# Altium project Exjobb.PrjPcb
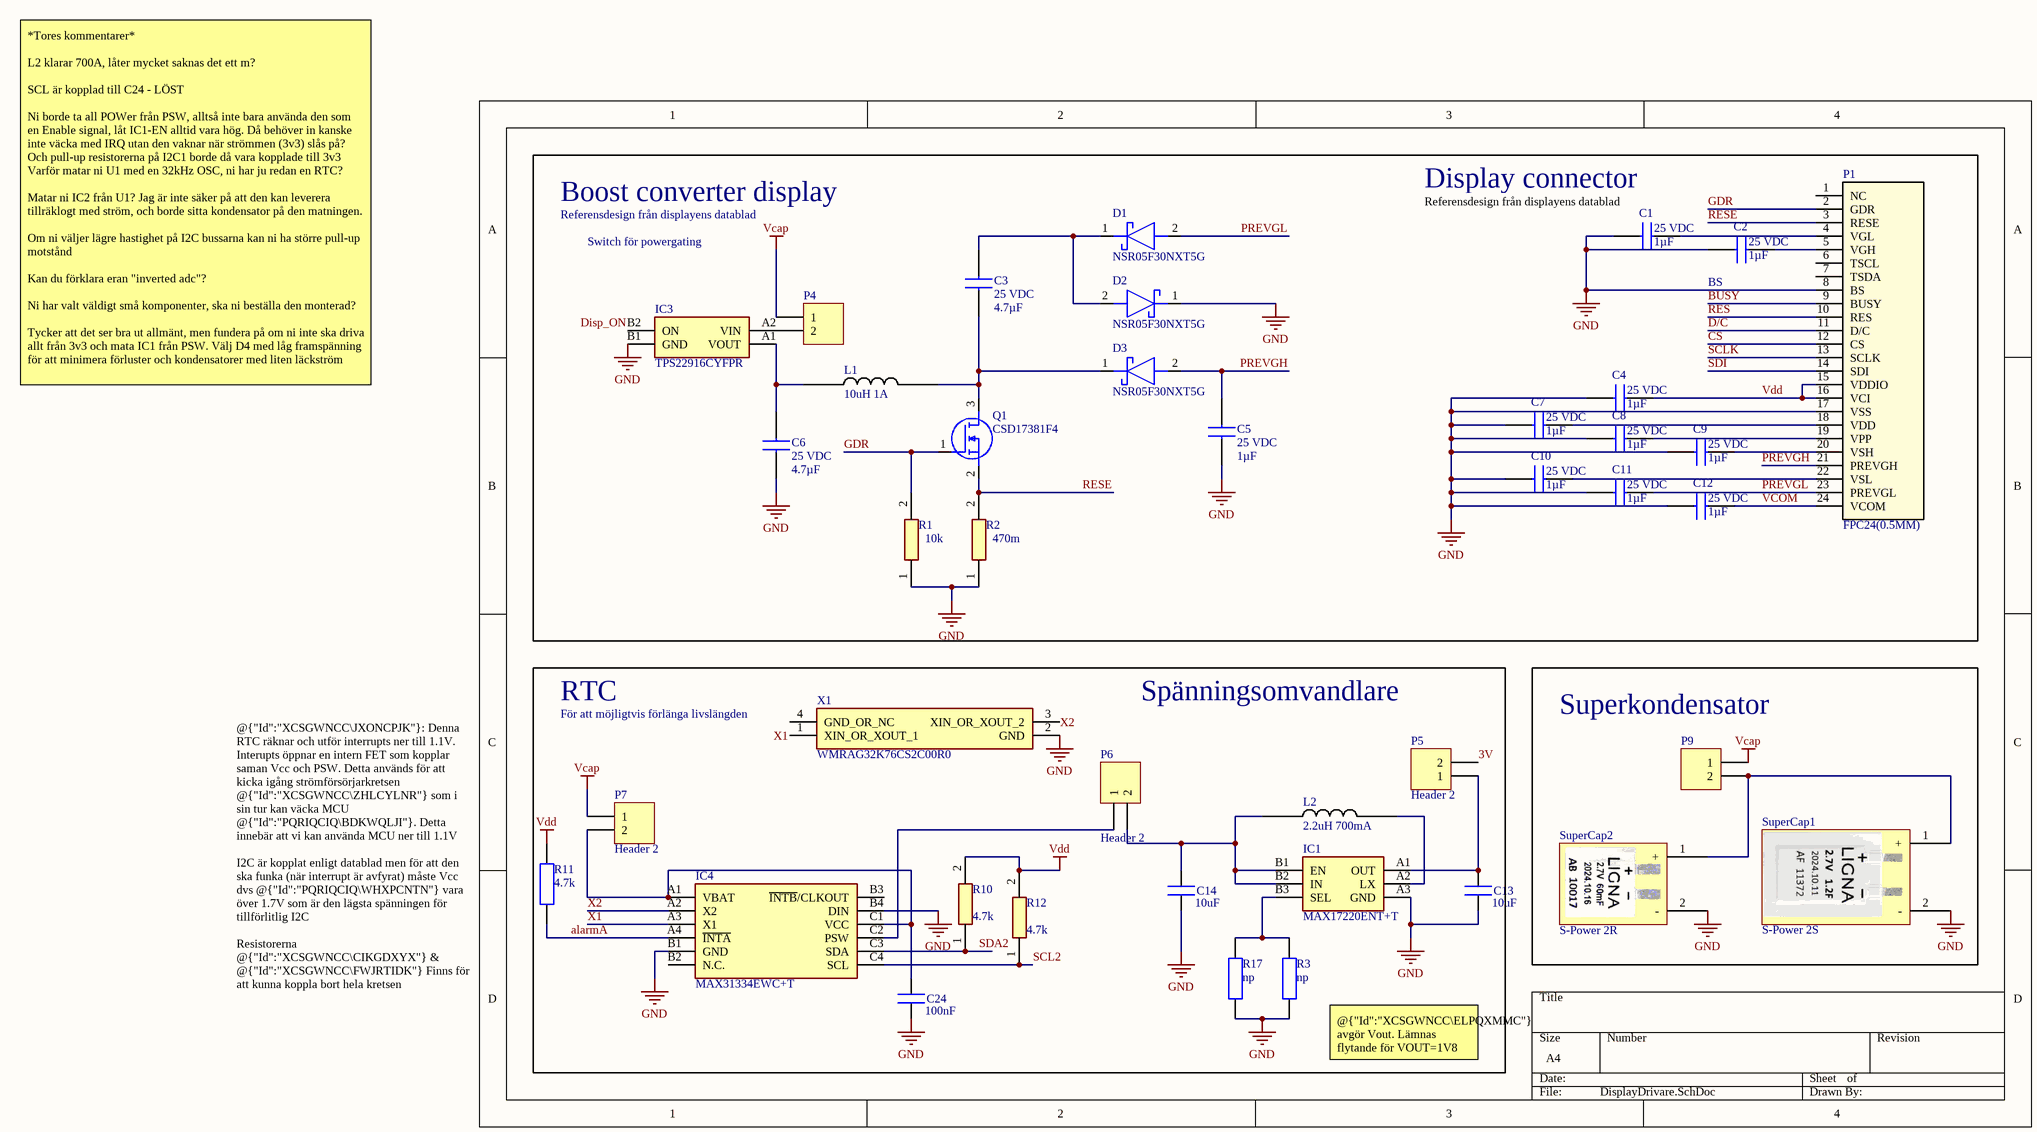
[diagram p0: DisplayDrivare.SchDoc]
2 sheets, 73 parts. Net scope: global (net labels, ports and power ports of the same name join across sheets).
Board files: PCB2.PcbDoc, PCB1.PcbDoc
Sheets:
  DisplayDrivare.SchDoc
  DigitalBlad.SchDoc

## Sheet DisplayDrivare.SchDoc
size A4; SheetNumber: 1; SheetTotal: 2

### Parts
C1  value 1µF  Rated Voltage: 25 VDC  [CAPC1005X55N]  (hidden comment: GRM155R61E105KA12D)
C2  value 1µF  Rated Voltage: 25 VDC  [CAPC1005X55N]  (hidden comment: GRM155R61E105KA12D)
C3  value 4.7µF  Rated Voltage: 25 VDC  [GRM15x]  (hidden comment: GRM155C61E475ME15J)
C4  value 1µF  Rated Voltage: 25 VDC  [CAPC1005X55N]  (hidden comment: GRM155R61E105KA12D)
C5  value 1µF  Rated Voltage: 25 VDC  [CAPC1005X55N]  (hidden comment: GRM155R61E105KA12D)
C6  value 4.7µF  Rated Voltage: 25 VDC  [GRM15x]  (hidden comment: GRM155C61E475ME15J)
C7  value 1µF  Rated Voltage: 25 VDC  [CAPC1005X55N]  (hidden comment: GRM155R61E105KA12D)
C8  value 1µF  Rated Voltage: 25 VDC  [CAPC1005X55N]  (hidden comment: GRM155R61E105KA12D)
C9  value 1µF  Rated Voltage: 25 VDC  [CAPC1005X55N]  (hidden comment: GRM155R61E105KA12D)
C10  value 1µF  Rated Voltage: 25 VDC  [CAPC1005X55N]  (hidden comment: GRM155R61E105KA12D)
C11  value 1µF  Rated Voltage: 25 VDC  [CAPC1005X55N]  (hidden comment: GRM155R61E105KA12D)
C12  value 1µF  Rated Voltage: 25 VDC  [CAPC1005X55N]  (hidden comment: GRM155R61E105KA12D)
C13  capacitance: 10uF  [CAPC1005X70N]  (hidden comment: AMK105CBJ106MV-F)
C14  capacitance: 10uF  [CAPC1005X70N]  (hidden comment: AMK105CBJ106MV-F)
C24  capacitance: 100nF  [CAPC1005X70N]  (hidden comment: MCAST105SB5104KFNA01)
D1  NSR05F30NXT5G  [NSR05F30NXT5G]
D2  NSR05F30NXT5G  [NSR05F30NXT5G]
D3  NSR05F30NXT5G  [NSR05F30NXT5G]
IC1  MAX17220ENT+T  [BGA6C40P3X2_142X89X50]
IC3  TPS22916CYFPR  [BGA4C40P2X2_78X78X50]
IC4  MAX31334EWC+T  [BGA12C50P4X3_197X147X69]
L1  Rating: 10uH 1A  [INDPM4341X80N]  (hidden comment: SRP0408F-100M)
L2  Rating: 2.2uH 700mA  [WE-PMI_080562]  (hidden comment: 74479774222)
P1  FPC24(0.5MM)  [FPC24 (0.5mm)]
P4  Header 2  [HDR1X2]  (value not drawn)
P5  Header 2  [HDR1X2]
P6  Header 2  [HDR1X2]
P7  Header 2  [HDR1X2]
P9  Header 2  [HDR1X2]  (value not drawn)
Q1  CSD17381F4  [CSD17381F4]
R1  Resistance: 10k  [RESC1005X40N]  (hidden comment: CRCW040210K0FKEDHP)
R2  Resistance: 470m  [RESC2012X65N]  (hidden comment: ERJ-U6QJR47V)
R3  resistance: np  [RESC1005X40N]  (hidden comment: CRT0402-BY-80R6GLF)
R10  Resistance: 4.7k  [RESC1005X40N]  (hidden comment: CRCW04024K70FKEDHP)
R11  resistance: 4.7k  [RESC1005X40N]  (hidden comment: CRCW04024K70FKEDHP)
R12  Resistance: 4.7k  [RESC1005X40N]  (hidden comment: CRCW04024K70FKEDHP)
R17  resistance: np  [RESC1005X40N]  (hidden comment: CRT0402-BY-80R6GLF)
SuperCap1  S-Power 2S  [S-Power 2S]
SuperCap2  S-Power 2R  [S-Power 2R]
X1  WMRAG32K76CS2C00R0  [WMRAG32K76CS2C00R0]

### Blocks framed on the sheet
Superkondensator: P9 SuperCap1 SuperCap2

### Nets
GND: C1.2 C2.2 C4.2 C5.1 C6.1 C7.2 C8.2 C9.2 C10.2 C11.2 C12.2 C13.1 C14.1 C24.2 D2.1(K) IC1.A3(GND) IC3.B1(GND) IC4.B1(GND) IC4.B4(DIN) P1.8(BS) P1.17(VSS) R1.1 R2.1 R3.1 R17.1 SuperCap1.2(-) SuperCap2.2(-) X1.2(GND)
Vcap: P4.1 P7.1 P9.1
Vdd: C4.1 P1.15(VDDIO) P1.16(VCI) R10.2 R11.1 R12.2
3V: P5.2
alarmA: IC4.A4(~{INTA}) R11.2
BUSY: P1.9(BUSY)
CS: P1.12(CS)
D/C: P1.11(D/C)
Disp_ON: IC3.B2(ON)
GDR: P1.2(GDR) Q1.1(G) R1.2
PREVGH: C5.2 D3.2(A) P1.21(PREVGH)
PREVGL: C11.1 D1.2(A) P1.23(PREVGL)
RES: P1.10(RES)
RESE: P1.3(RESE) Q1.2(S) R2.2
SCL2: IC4.C4(SCL) R12.1
SCLK: P1.13(SCLK)
SDA2: IC4.C3(SDA) R10.1
SDI: P1.14(SDI)
VCOM: C12.1 P1.24(VCOM)
X1: IC4.A3(X1) X1.1(XIN_OR_XOUT_1)
X2: IC4.A2(X2) X1.3(XIN_OR_XOUT_2)
NetC1_1: C1.1 P1.4(VGL)
NetC2_1: C2.1 P1.5(VGH)
NetC3_1: C3.1 D3.1(K) L1.2 Q1.3(D)
NetC3_2: C3.2 D1.1(K) D2.2(A)
NetC6_2: C6.2 IC3.A1(VOUT) L1.1
NetC7_1: C7.1 P1.18(VDD)
NetC8_1: C8.1 P1.19(VPP)
NetC9_1: C9.1 P1.20(VSH)
NetC10_1: C10.1 P1.22(VSL)
NetC13_2: C13.2 IC1.A1(OUT) P5.1
NetC14_2: C14.2 IC1.B1(EN) IC1.B2(IN) L2.1 P6.2
NetC24_1: C24.1 IC4.A1(VBAT) IC4.C1(VCC) P7.2
NetIC1_A2: IC1.A2(LX) L2.2
NetIC1_B3: IC1.B3(SEL) R3.2 R17.2
NetIC3_A2: IC3.A2(VIN) P4.2
NetIC4_C2: IC4.C2(PSW) P6.1
NetP9_2: P9.2 SuperCap1.1(+) SuperCap2.1(+)

Not connected (* = marked no-connect by the designer): IC4 B2(N.C.) B3(~{INTB}/CLKOUT); P1 1(NC) 6(TSCL) 7(TSDA); X1 4(GND_OR_NC)

### Notes on the sheet
- Boost converter display
- (near C1) Display connector
- (near C1) Referensdesign från displayens datablad
- Referensdesign från displayens datablad
- Switch för powergating
- (near C2) BS
- *Tores kommentarer*
  L2 klarar 700A, låter mycket saknas det ett m?
  SCL är kopplad till C24 - LÖST
  Ni borde ta all POWer från PSW, alltså inte bara använda den som en Enable signal, låt IC1-EN alltid vara hög. Då behöver in kanske inte väcka med IRQ utan den vaknar när strömmen (3v3) slås på? Och pull-up resistorerna på I2C1 borde då vara kopplade till 3v3
  Varför matar ni U1 med en 32kHz OSC, ni har ju redan en RTC?
  Matar ni IC2 från U1? Jag är inte säker på att den kan leverera tillräklogt med ström, och borde sitta kondensator på den matningen.
  Om ni väljer lägre hastighet på I2C bussarna kan ni ha större pull-up motstånd
  Kan du förklara eran "inverted adc"?
  Ni har valt väldigt små komponenter, ska ni beställa den monterad?
  Tycker att det ser bra ut allmänt, men fundera på om ni inte ska driva allt från 3v3 och mata IC1 från PSW. Välj D4 med låg framspänning för att minimera förluster och kondensatorer med liten läckström
- (near X1) För att möjligtvis förlänga livslängden
- RTC
- Spänningsomvandlare
- @{"Id":"XCSGWNCC\JXONCPJK"}: Denna RTC räknar och utför interrupts ner till 1.1V. Interupts öppnar en intern FET som kopplar saman Vcc och PSW. Detta används för att kicka igång strömförsörjarkretsen @{"Id":"XCSGWNCC\ZHLCYLNR"} som i sin tur kan väcka MCU @{"Id":"PQRIQCIQ\BDKWQLJI"}. Detta innebär att vi kan använda MCU ner till 1.1V
  I2C är kopplat enligt datablad men för att den ska funka (när interrupt är avfyrat) måste Vcc dvs @{"Id":"PQRIQCIQ\WHXPCNTN"} vara över 1.7V som är den lägsta spänningen för tillförlitlig I2C
  Resistorerna @{"Id":"XCSGWNCC\CIKGDXYX"} & @{"Id":"XCSGWNCC\FWJRTIDK"} Finns för att kunna koppla bort hela kretsen
- (near R3) @{"Id":"XCSGWNCC\ELPQXMMC"} avgör Vout. Lämnas flytande för VOUT=1V8
  133kohk = > 3V

### Library data of the parts
C1 C2 C4 C5 C7-C12 = CMP-001-00126-1: Capacitor; Manufacturer_Name: Murata Electronics; Datasheet Link: https://search.murata.co.jp/Ceramy/image/img/A01X/G101/ENG/GRM155R61E105KA12-01A.pdf; Source: SamacSys.SchLib; Mouser Part Number: 81-GRM155R61E105KA2D; Arrow Part Number: GRM155R61E105KA12D; Manufacturer_Part_Number: GRM155R61E105KA12D; Design Item ID: GRM155R61E105KA12D; Arrow Price/Stock: https://www.arrow.com/en/products/grm155r61e105ka12d/murata-manufacturing?region=nac; Height: 0.55mm; Mouser Price/Stock: https://www.mouser.co.uk/ProductDetail/Murata-Electronics/GRM155R61E105KA12D?qs=hiffU4J9V6bE4a81t2Mv5A%3D%3D
C3 C6 = CMP-001-00127-1: Capacitor; Manufacturer_Name: Murata Electronics; Height: 0.5mm; Source: SamacSys.SchLib; Arrow Price/Stock: https://www.arrow.com/en/products/grm155c61e475me15j/murata-manufacturing?region=nac; Mouser Part Number: 81-GRM15C61E475ME15J; Arrow Part Number: GRM155C61E475ME15J; Manufacturer_Part_Number: GRM155C61E475ME15J; Design Item ID: GRM155C61E475ME15J; Mouser Price/Stock: https://www.mouser.co.uk/ProductDetail/Murata-Electronics/GRM155C61E475ME15J?qs=By6Nw2ByBD02p8xq06vhEQ%3D%3D; Datasheet Link: https://search.murata.co.jp/Ceramy/image/img/A01X/G101/ENG/GRM155C61E475ME15-01A.pdf
C13 C14 = Generic capacitor: Multilayer Ceramic Capacitors MLCC - SMD/SMT 4V 10uF X5R 0402 20 %; ComponentLink1Description: New link; ComponentLink1URL: https://www.mouser.se/ProductDetail/TAIYO-YUDEN/AMK105CBJ106MV-F?qs=sGAEpiMZZMsh%252B1woXyUXj0Cks%252BXuBt5iPLxjTe7mki8%3D
C24 = Generic capacitor: Multilayer Ceramic Capacitors MLCC - SMD/SMT 25V 0.1uF X5R 0402 10% Medical; ComponentLink1Description: New link; ComponentLink1URL: https://www.mouser.se/ProductDetail/TAIYO-YUDEN/MLAST105SB5104KFNA01?qs=sGAEpiMZZMsh%252B1woXyUXj3XUfju0vRpjIEu19pL458I%3D
D1-D3 = CMP-004-00034-1: Schottky Diode; Manufacturer_Name: onsemi; Arrow Part Number: NSR05F30NXT5G; Height: 0.31mm; Datasheet Link: https://www.onsemi.com/pub/Collateral/NSR05F30.PDF; Source: SamacSys.SchLib; Arrow Price/Stock: https://www.arrow.com/en/products/nsr05f30nxt5g/on-semiconductor?region=nac; Mouser Price/Stock: https://www.mouser.co.uk/ProductDetail/onsemi/NSR05F30NXT5G?qs=Ddzdinyxz%2FkBCezibUxhIA%3D%3D; Design Item ID: NSR05F30NXT5G; Mouser Part Number: 863-NSR05F30NXT5G; Manufacturer_Part_Number: NSR05F30NXT5G
IC1 = CMP-031-00089-1: MAXIM INTEGRATED PRODUCTS - MAX17220ENT+T - DC-DC Switching Step Up Regulator; Manufacturer_Name: Analog Devices; Source: SamacSys.SchLib; Arrow Part Number: MAX17220ENT+T; Design Item ID: MAX17220ENT+T; Height: 0.5mm; Datasheet Link: https://www.analog.com/MAX17220/datasheet; Arrow Price/Stock: https://www.arrow.com/en/products/max17220entt/analog-devices?region=nac; Manufacturer_Part_Number: MAX17220ENT+T; Mouser Price/Stock: https://www.mouser.co.uk/ProductDetail/Analog-Devices-Maxim-Integrated/MAX17220ENT%2bT?qs=BZBei1rCqCAO5QX%2FSv6p6w%3D%3D; Mouser Part Number: 700-MAX17220ENT+T; Supplier: Mouser; Supplier Part Number: 594-MCS04020D8062BE0
IC3 = CMP-031-00019-1: TPS22916 5.5-V; Manufacturer_Name: Texas Instruments; Manufacturer_Part_Number: TPS22916CYFPR; Source: SamacSys.SchLib; Design Item ID: TPS22916CYFPR; Mouser Part Number: 595-TPS22916CYFPR; Mouser Price/Stock: https://www.mouser.co.uk/ProductDetail/Texas-Instruments/TPS22916CYFPR?qs=EU6FO9ffTweddKR4NsfVQg%3D%3D; Datasheet Link: http://www.ti.com/lit/gpn/tps22916; Arrow Price/Stock: https://www.arrow.com/en/products/tps22916cyfpr/texas-instruments?utm_currency=USD&region=nac; Height: 0.5mm; Arrow Part Number: TPS22916CYFPR
IC4 = CMP-031-00017-1: Ultra-Low-Power Real Time Clock with Integrated Power Switch; Manufacturer_Name: Analog Devices; Source: SamacSys.SchLib; Height: 0.69mm; Manufacturer_Part_Number: MAX31334EWC+T; Datasheet Link: https://www.analog.com/MAX31334/datasheet; Mouser Price/Stock: https://www.mouser.co.uk/ProductDetail/Analog-Devices-Maxim-Integrated/MAX31334EWC%2bT?qs=vvQtp7zwQdOckJhTSGVMeA%3D%3D; Arrow Part Number: MAX31334EWC+T; Arrow Price/Stock: https://www.arrow.com/en/products/max31334ewct/analog-devices?region=nac; Mouser Part Number: 700-MAX31334EWC+T; Design Item ID: MAX31334EWC+T
L1 = CMP-006-00031-1: Power Inductors - SMD 10 UH 20%; Design Item ID: SRP0408F-100M; Source: SamacSys.SchLib
L2 = CMP-006-00060-1: Inductor-WE; Source: Schlib.SchLib; Design Item ID: 74479774222
P1 = FPC24(0.5MM): No Description Available; Mfr_Name: Molex Connector Corporation; RefDes: RefDes; Type: Type
P4-P7 P9 = CMP-002-00143-1: Header, 2-Pin; Signal Integrity: Connector; LatestRevisionNote: Re-released for DXP Platform.; Publisher: Altium Limited; Pins: 2; LatestRevisionDate: 17-Jul-2002; Design Item ID: Header 2; Component Type: Standard; Source: Miscellaneous Connectors.SchLib
Q1 = CMP-102-000001-1: MOSFET (N-Channel); Manufacturer_Name: Texas Instruments; Mouser Price/Stock: https://www.mouser.co.uk/ProductDetail/Texas-Instruments/CSD17381F4?qs=aG%252B9dtamCDf9%2FrYwJezivw%3D%3D; Design Item ID: CSD17381F4; Manufacturer_Part_Number: CSD17381F4; Mouser Part Number: 595-CSD17381F4; Source: SamacSys.SchLib; Height: 0.36mm; Datasheet Link: https://www.ti.com/lit/gpn/csd17381f4?HQS=ti-null-null-sf-df-pf-sep-wwe&DCM=yes?hkey=EF798316E3902B6ED9A73243A3159BB0
R1 = CMP-009-00221-1: CRCW Power Resistor 0402 0.063W 10K Vishay CRCW Series Thick Film Power Resistor 0402 Case 10k +/-1% 0.125W +/-100ppm/K; Manufacturer_Part_Number: CRCW040210K0FKEDHP; Design Item ID: CRCW040210K0FKEDHP; Arrow Part Number: CRCW040210K0FKEDHP; Datasheet Link: http://www.vishay.com/docs/20035/dcrcwe3.pdf; Mouser Part Number: 71-CRCW040210K0FKEDH; Height: 0.4mm; Arrow Price/Stock: https://www.arrow.com/en/products/crcw040210k0fkedhp/vishay?utm_currency=USD&region=nac; Source: SamacSys.SchLib; Manufacturer_Name: Vishay; Mouser Price/Stock: https://www.mouser.co.uk/ProductDetail/Vishay-Dale/CRCW040210K0FKEDHP?qs=FlFvgi4rxBxmIiaeyFjrkA%3D%3D
R2 = CMP-009-00220-1: Thick Film Resistors - SMD 0805 0.25W 5% .47ohms AEC-Q200; Manufacturer_Name: Panasonic; Design Item ID: ERJ-U6QJR47V; Datasheet Link: https://industrial.panasonic.com/cdbs/www-data/pdf/RDP0000/AOA0000C334.pdf; Manufacturer_Part_Number: ERJ-U6QJR47V; Mouser Price/Stock: https://www.mouser.co.uk/ProductDetail/Panasonic/ERJ-U6QJR47V?qs=5aG0NVq1C4wLyK2PwyO%252BIA%3D%3D; Height: 0.65mm; Source: SamacSys.SchLib; Mouser Part Number: 667-ERJ-U6QJR47V
R3 R17 = Generic resistor: Thin Film Resistors 1/16watts 80.6 ohm 0.10%; ComponentLink1Description: New link; ComponentLink1URL: https://www.mouser.se/ProductDetail/Bourns/CRT0402-BY-80R6GLF?qs=sGAEpiMZZMvdGkrng054tyoJODJe%252BCGW7Yc230%2FWBYo%3D
R10 R12 = CMP-009-00230-1: CRCW Power Resistor 0402 0.063W 4K7 Vishay CRCW Series Thick Film Power Resistor 0402 Case 4.7k +/-1% 0.125W +/-100ppm/K; Source: SamacSys.SchLib; Height: 0.4mm; Manufacturer_Name: Vishay; Datasheet Link: http://www.vishay.com/docs/20035/dcrcwe3.pdf; Manufacturer_Part_Number: CRCW04024K70FKEDHP; Arrow Part Number: CRCW04024K70FKEDHP; Design Item ID: CRCW04024K70FKEDHP; Mouser Price/Stock: https://www.mouser.co.uk/ProductDetail/Vishay-Dale/CRCW04024K70FKEDHP?qs=k2%2FDWSARqgH3ASlI4vM3KQ%3D%3D; Mouser Part Number: 71-CRCW04024K70FKEDH; Arrow Price/Stock: https://www.arrow.com/en/products/crcw04024k70fkedhp/vishay?utm_currency=USD&region=nac
R11 = Generic resistor: CRCW Power Resistor 0402 0.063W 4K7 Vishay CRCW Series Thick Film Power Resistor 0402 Case 4.7k +/-1% 0.125W +/-100ppm/K; ComponentLink1Description: New link; ComponentLink1URL: *
SuperCap1 = CMP-111-000002-1: Design Item ID: S-Power 2S; Source: Schlib.SchLib
SuperCap2 = CMP-111-000001-1: Design Item ID: S-Power 2R; Source: Schlib.SchLib
X1 = CMP-003-00031-1: 32.768 kHz +/-20ppm Crystal 8pF 75 kOhms 4-SMD; Manufacturer_Name: Murata Electronics; Manufacturer_Part_Number: WMRAG32K76CS2C00R0; Mouser Part Number: 81-WMRAG32K76CS2C00R; Source: SamacSys.SchLib; Height: 0.35mm; Datasheet Link: https://www.murata.com/products/productdata/8804604674078/SPEC-WMRAG32K76CS2C00R0.pdf; Design Item ID: WMRAG32K76CS2C00R0; Mouser Price/Stock: https://www.mouser.co.uk/ProductDetail/Murata-Electronics/WMRAG32K76CS2C00R0?qs=bZr6mbWTK5kWV2uyypDEfg%3D%3D

## Sheet DigitalBlad.SchDoc
size A4; SheetNumber: 2; SheetTotal: 2; SPICEModelCachePQRIQCIQ: <root> / <DocumentId>PQRIQCIQ</DocumentId> / </root>
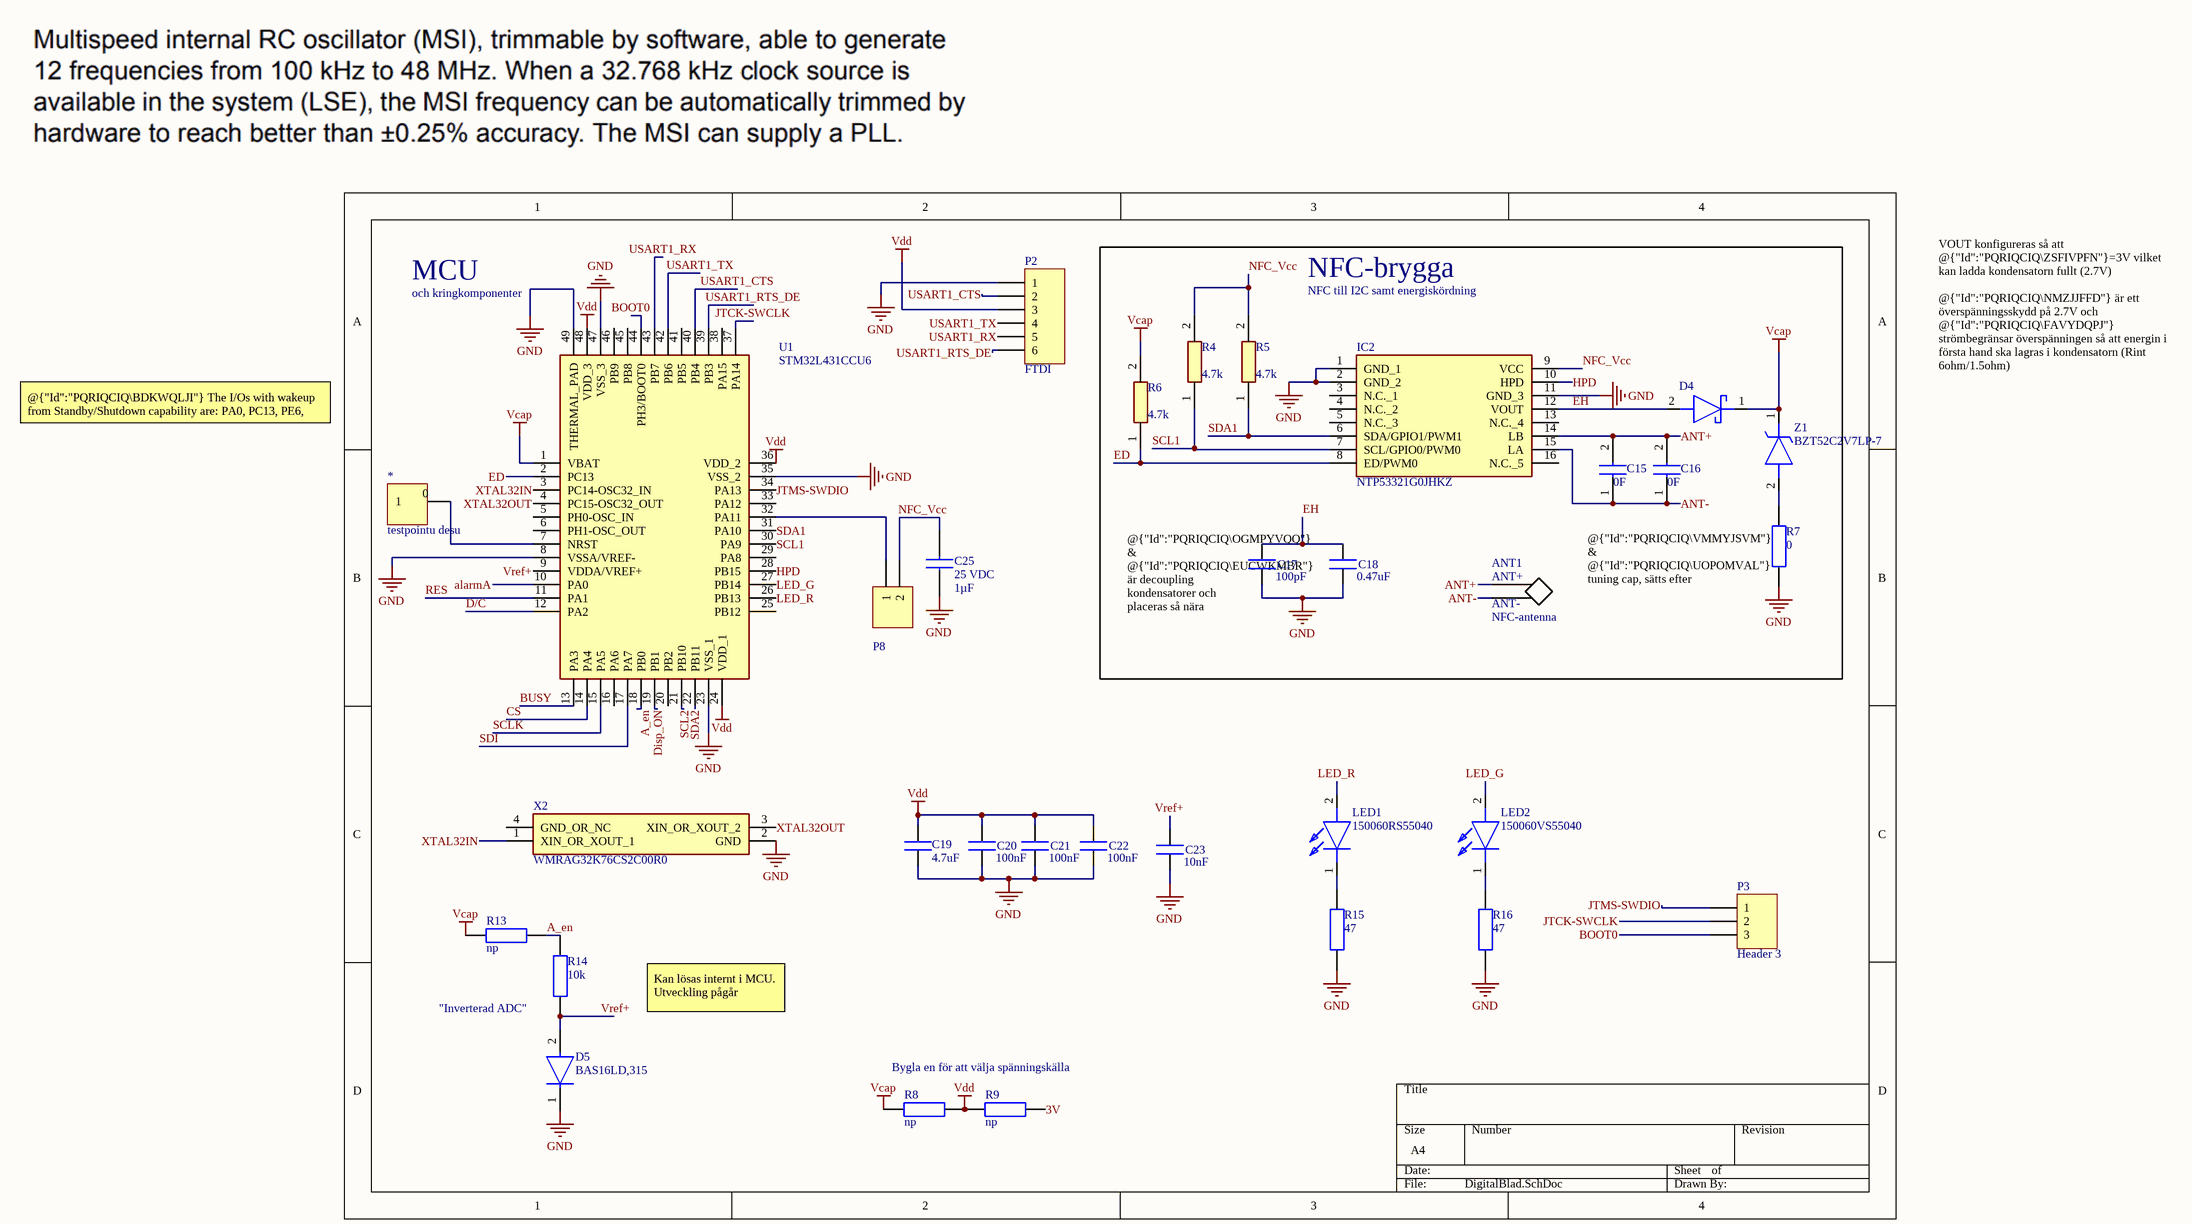
[diagram p1: DigitalBlad.SchDoc]

### Parts
*  testpointu desu  [Testupoint]
ANT1  NFC-antenna  [Antenna1]
C15  value 0F  [CAPC1005X70N]  (hidden comment: GRM155C81C474KE01D)
C16  value 0F  [CAPC1005X70N]  (hidden comment: GRM155C81C474KE01D)
C17  capacitance: 100pF  [CAPC1005X70N]  (hidden comment: C0402C101KCGACAUTO)
C18  capacitance: 0.47uF  [CAPC1005X70N]  (hidden comment: C0402C101KCMBASJ105SB7474KFNA01GACAUTO)
C19  capacitance: 4.7uF  [CAPC1005X70N]  (hidden comment: C0402C475K8PACTU)
C20  capacitance: 100nF  [CAPC1005X70N]  (hidden comment: MLAST105SB5104KFNA01)
C21  capacitance: 100nF  [CAPC1005X70N]  (hidden comment: MLAST105SB5104KFNA01)
C22  capacitance: 100nF  [CAPC1005X70N]  (hidden comment: MLAST105SB5104KFNA01)
C23  capacitance: 10nF  [CAPC1005X70N]  (hidden comment: VJ0402Y103KXJAC31X)
C25  value 1µF  Rated Voltage: 25 VDC  [CAPC1005X55N]  (hidden comment: GRM155R61E105KA12D)
D4  RBE01VYM6AFHTR  [RBE01VYM6AFHTR]  (value not drawn)
D5  BAS16LD,315  [FP-SOD882D-MFG]
IC2  NTP53321G0JHKZ  [NTP53321G0JHKZ]
LED1  150060RS55040  [150060RS55040]
LED2  150060VS55040  [LEDM168X50N]
P2  FTDI  [HDR1X6]
P3  Header 3  [HDR1X3]
P8  Header 2  [HDR1X2]  (value not drawn)
R4  Resistance: 4.7k  [RESC1005X40N]  (hidden comment: CRCW04024K70FKEDHP)
R5  Resistance: 4.7k  [RESC1005X40N]  (hidden comment: CRCW04024K70FKEDHP)
R6  Resistance: 4.7k  [RESC1005X40N]  (hidden comment: CRCW04024K70FKEDHP)
R7  resistance: 0  [RESC1005X40N]  (hidden comment: SFR01MZPJ470)
R8  resistance: np  [RESC1005X40N]  (hidden comment: Generic component)
R9  resistance: np  [RESC1005X40N]  (hidden comment: Generic component)
R13  resistance: np  [RESC1005X40N]  (hidden comment: Generic component)
R14  resistance: 10k  [RESC1005X40N]  (hidden comment: CRCW04024K70FKEDHP)
R15  resistance: 47  [RESC1005X40N]  (hidden comment: SFR01MZPJ470)
R16  resistance: 47  [RESC1005X40N]  (hidden comment: SFR01MZPJ470)
U1  STM32L431CCU6  [QFN50P700X700X60-49N-D]
X2  WMRAG32K76CS2C00R0  [WMRAG32K76CS2C00R0]
Z1  BZT52C2V7LP-7  [BZT52C2V7LP7]

### Blocks framed on the sheet
NFC-brygga: ANT1 C15-C18 D4 IC2 R4-R7 Z1

### Nets
GND: C17.1 C18.1 C19.2 C20.2 C21.2 C22.2 C23.2 C25.2 D5.1(C) IC2.1(GND_1) IC2.2(GND_2) IC2.11(GND_3) P2.1 R7.2 R15.1 R16.1 U1.8(VSSA/VREF-) U1.23(VSS_1) U1.35(VSS_2) U1.47(VSS_3) U1.49(THERMAL_PAD) X2.2(GND)
Vcap: D4.1(K) R6.2 R8.2 R13.2 U1.1(VBAT) Z1.1(K)
Vdd: C19.1 C20.1 C21.1 C22.1 P2.3 R8.1 R9.2 U1.24(VDD_1) U1.36(VDD_2) U1.48(VDD_3)
3V: R9.1
A_en: R13.1 R14.2 U1.18(PB0)
alarmA: U1.10(PA0)
ANT+: ANT1.1(+) C15.2 C16.2 IC2.14(LB)
ANT-: ANT1.1(-) C15.1 C16.1 IC2.15(LA)
BOOT0: P3.3 U1.44(PH3/BOOT0)
BUSY: U1.13(PA3)
CS: U1.14(PA4)
D/C: U1.12(PA2)
Disp_ON: U1.19(PB1)
ED: IC2.8(ED/PWM0) R6.1 U1.2(PC13)
EH: C17.2 C18.2 D4.2(A) IC2.12(VOUT)
HPD: IC2.10(HPD) U1.28(PB15)
JTCK-SWCLK: P3.2 U1.37(PA14)
JTMS-SWDIO: P3.1 U1.34(PA13)
LED_G: LED2.2(A) U1.27(PB14)
LED_R: LED1.2(A) U1.26(PB13)
NFC_Vcc: C25.1 IC2.9(VCC) P8.2 R4.2 R5.2
RES: U1.11(PA1)
SCL1: IC2.7(SCL/GPIO0/PWM0) R4.1 U1.30(PA9)
SCL2: U1.21(PB10)
SCLK: U1.15(PA5)
SDA1: IC2.6(SDA/GPIO1/PWM1) R5.1 U1.31(PA10)
SDA2: U1.22(PB11)
SDI: U1.17(PA7)
USART1_CTS: P2.2 U1.40(PB4)
USART1_RTS_DE: P2.6 U1.39(PB3)
USART1_RX: P2.5 U1.43(PB7)
USART1_TX: P2.4 U1.42(PB6)
Vref+: C23.1 D5.2(A) R14.1 U1.9(VDDA/VREF+)
XTAL32IN: U1.3(PC14-OSC32_IN) X2.1(XIN_OR_XOUT_1)
XTAL32OUT: U1.4(PC15-OSC32_OUT) X2.3(XIN_OR_XOUT_2)
Net*_0: *.0(1) U1.7(NRST)
NetLED1_1: LED1.1(K) R15.2
NetLED2_1: LED2.1(K) R16.2
NetP8_1: P8.1 U1.32(PA11)
NetR7_1: R7.1 Z1.2(A)

Not connected (* = marked no-connect by the designer): IC2 3(N.C._1) 4(N.C._2) 5(N.C._3) 13(N.C._4) 16(N.C._5); U1 5(PH0-OSC_IN) 6(PH1-OSC_OUT) 16(PA6) 20(PB2) 25(PB12) 29(PA8) 33(PA12) 38(PA15) 41(PB5) 45(PB8) 46(PB9); X2 4(GND_OR_NC)

### Notes on the sheet
- MCU
- och kringkomponenter
- NFC till I2C samt energiskördning
- @{"Id":"PQRIQCIQ\BDKWQLJI"} The I/Os with wakeup from Standby/Shutdown capability are: PA0, PC13, PE6, PA2, PC5.
- VOUT konfigureras så att @{"Id":"PQRIQCIQ\ZSFIVPFN"}=3V vilket kan ladda kondensatorn fullt (2.7V)
  @{"Id":"PQRIQCIQ\NMZJJFFD"} är ett överspänningsskydd på 2.7V och @{"Id":"PQRIQCIQ\FAVYDQPJ"} strömbegränsar överspänningen så att energin i första hand ska lagras i kondensatorn (Rint  6ohm/1.5ohm)
- (near C17) @{"Id":"PQRIQCIQ\OGMPYVQQ"} & @{"Id":"PQRIQCIQ\EUCWKMBR"}
  är decoupling kondensatorer och placeras så nära NTPn som möjligt
- @{"Id":"PQRIQCIQ\VMMYJSVM"} & @{"Id":"PQRIQCIQ\UOPOMVAL"}
  tuning cap, sätts efter uppmätt induktans på antennen
- (near R14) "Inverterad ADC"
- Kan lösas internt i MCU. Utveckling pågår
- Bygla en för att välja spänningskälla
- (in symbol NFC-antenna) ANT+; ANT-

### Library data of the parts
C15 C16 = CMP-001-00140-1: Multilayer Ceramic Capacitors MLCC - SMD/SMT; Manufacturer_Name: Murata Electronics; Design Item ID: GRM155C81C474KE01D; Mouser Part Number: 81-GRM155C81C474KE1D; Height: 0.7mm; Source: SamacSys.SchLib; Mouser Price/Stock: https://www.mouser.com/Search/Refine.aspx?Keyword=81-GRM155C81C474KE1D; Manufacturer_Part_Number: GRM155C81C474KE01D; Datasheet Link: https://search.murata.co.jp/Ceramy/image/img/A01X/G101/ENG/GRM155C81C474KE01-01A.pdf
C17 C18 = Generic capacitor: Multilayer Ceramic Capacitors MLCC - SMD/SMT 500V 0.0001uF C0G 0402 10% AEC-Q200; ComponentLink1Description: New link
  C17: ComponentLink1URL: https://www.mouser.se/ProductDetail/KEMET/C0402C101KCGACAUTO?qs=1Kr7Jg1SGW8kQysZZQPmCw%3D%3D
  C18: ComponentLink1URL: https://www.mouser.se/ProductDetail/TAIYO-YUDEN/MBASJ105SB7474KFNA01?qs=tlsG%2FOw5FFh70%252Bw5vm%252Bxgg%3D%3D
C19 = Generic capacitor: Multilayer Ceramic Capacitors MLCC - SMD/SMT; ComponentLink1Description: New link; ComponentLink1URL: https://www.mouser.se/ProductDetail/TAIYO-YUDEN/MLASJ105BB5475MFNA01?qs=sGAEpiMZZMsh%252B1woXyUXj3XUfju0vRpjpyIV14TsoXE%3D
C20-C22 = Generic capacitor: as C24 on sheet DisplayDrivare; ComponentLink1Description: New link; ComponentLink1URL: https://www.mouser.se/ProductDetail/TAIYO-YUDEN/MLAST105SB5104KFNA01?qs=sGAEpiMZZMsh%252B1woXyUXj3XUfju0vRpjIEu19pL458I%3D
C23 = Generic capacitor: Multilayer Ceramic Capacitors MLCC - SMD/SMT 0402 10nF 16volts X7R 10%; ComponentLink1Description: New link; ComponentLink1URL: https://www.mouser.se/ProductDetail/Vishay-Vitramon/VJ0402Y103KXJAC31X?qs=sGAEpiMZZMsh%252B1woXyUXj7JttxwcgSfbi%2FPlga%252BwiEM%3D
C25 = CMP-001-00126-1: as C1 on sheet DisplayDrivare; Datasheet Link: https://search.murata.co.jp/Ceramy/image/img/A01X/G101/ENG/GRM155R61E105KA12-01A.pdf; Source: SamacSys.SchLib; Mouser Part Number: 81-GRM155R61E105KA2D; Arrow Part Number: GRM155R61E105KA12D; Manufacturer_Part_Number: GRM155R61E105KA12D; Design Item ID: GRM155R61E105KA12D; Arrow Price/Stock: https://www.arrow.com/en/products/grm155r61e105ka12d/murata-manufacturing?region=nac; Height: 0.55mm; Mouser Price/Stock: https://www.mouser.co.uk/ProductDetail/Murata-Electronics/GRM155R61E105KA12D?qs=hiffU4J9V6bE4a81t2Mv5A%3D%3D
D4 = CMP-004-00062-1: DIODE SCHOTTKY 6V 100MA TUMD2M; Manufacturer_Name: ROHM Semiconductor; Mouser Part Number: 755-RBE01VYM6AFHTR; Datasheet Link: https://www.digikey.ph/en/products/detail/rohm-semiconductor/RBE01VYM6AFHTR/24634517; Manufacturer_Part_Number: RBE01VYM6AFHTR; Source: SamacSys.SchLib; Design Item ID: RBE01VYM6AFHTR; Mouser Price/Stock: https://www.mouser.co.uk/ProductDetail/ROHM-Semiconductor/RBE01VYM6AFHTR?qs=VVKQmw408U8czvswzPLZtQ%3D%3D; Height: 0.8mm
D5 = CMP-14399-000004-1: DIODE GP 100V 215MA SOD882D; Manufacturer: Nexperia; Value: 1.5pF; Max Junction Temp: +150°C; Max Surge Forward Current: 0.5A; Peak Reverse Current: 0.5uA; Automotive Grade: Grade 0; Package: SOD882D; Category: Diode; Automotive: Yes; Footprint Url: https://assets.nexperia.com/documents/outline-drawing/SOD882D.pdf; RoHS: TRUE; ComponentLink2Description: Datasheet; Height: 0.4mm; Digikey Description: DIODE GP 100V 215MA SOD882D; Device Class L1: Discrete Semiconductors; Ambient Temperature Range High: +150°C; Capacitance: 1.5pF; Manufacturer Part Number: BAS16LD,315; Ambient Temperature Range Low: -55°C; Temperature: to +150°C; Max Repetitive Reverse Voltage: 100V; Temperature Range High: +150°C; Reverse Voltage: 100V; ComponentLink2URL: https://assets.nexperia.com/documents/data-sheet/BAS16LD.pdf; Octopart: https://octopart.com/bas16ld%2C315-nexperia-78753474; Device Class L3: Rectifier Diodes; Forward Current: 215mA; Device Class L2: Diodes; Mouser Description: BAS16LD - Single high-speed switching diode; Lead Free: Yes
IC2 = CMP-031-00011-1: Interface - Specialized NTAG; Manufacturer_Name: NXP; Source: SamacSys.SchLib; Mouser Price/Stock: https://www.mouser.co.uk/ProductDetail/NXP-Semiconductors/NTP53321G0JHKZ?qs=u16ybLDytRYy2Rt%2Fib73Dw%3D%3D; Height: 0.5mm; Design Item ID: NTP53321G0JHKZ; Datasheet Link: https://www.nxp.com/docs/en/data-sheet/NTP53x2.pdf; Arrow Price/Stock: https://www.arrow.com/en/products/ntp53321g0jhkz/nxp-semiconductors?region=nac; Mouser Part Number: 771-NTP53321G0JHKZ; Manufacturer_Part_Number: NTP53321G0JHKZ; Arrow Part Number: NTP53321G0JHKZ
LED1 = CMP-007-00073-1: RED Standard LEDs - SMD WL-SMCD SMD MonoChip 0603 Red 632nm; Manufacturer_Name: Wurth Elektronik; Mouser Part Number: 710-150060RS55040; Mouser Price/Stock: https://www.mouser.co.uk/ProductDetail/Wurth-Elektronik/150060RS55040?qs=8Aam6%252B7C6HHnMZFlrlTntA%3D%3D; Manufacturer_Part_Number: 150060RS55040; Datasheet Link: http://katalog.we-online.de/led/datasheet/150060RS55040.pdf; Design Item ID: 150060RS55040; Source: SamacSys.SchLib; Height: 0mm
LED2 = CMP-007-00074-1: Green LED; Manufacturer_Name: Wurth Elektronik; Mouser Part Number: 710-150060VS55040; Manufacturer_Part_Number: 150060VS55040; Datasheet Link: https://katalog.we-online.com/led/datasheet/150060VS55040.pdf; Design Item ID: 150060VS55040; Source: SamacSys.SchLib; Mouser Price/Stock: https://www.mouser.co.uk/ProductDetail/Wurth-Elektronik/150060VS55040?qs=8Aam6%252B7C6HEumg%252B0cJZzvA%3D%3D; Height: 0.5mm
P2 = CMP-002-00359-1: Header, 6-Pin; Signal Integrity: Connector; Source: Miscellaneous Connectors.SchLib; Pins: 6; Component Type: Standard; Design Item ID: Header 6; LatestRevisionDate: 17-Jul-2002; Publisher: Altium Limited; LatestRevisionNote: Re-released for DXP Platform.
P3 = CMP-002-00163-1: Header, 3-Pin; Signal Integrity: Connector; Source: Miscellaneous Connectors.SchLib; LatestRevisionNote: Re-released for DXP Platform.; Design Item ID: Header 3; Pins: 3; LatestRevisionDate: 17-Jul-2002; Component Type: Standard; Publisher: Altium Limited
P8 = CMP-002-00143-1: as P4 on sheet DisplayDrivare; LatestRevisionNote: Re-released for DXP Platform.; Publisher: Altium Limited; Pins: 2; LatestRevisionDate: 17-Jul-2002; Design Item ID: Header 2; Component Type: Standard; Source: Miscellaneous Connectors.SchLib
R4-R6 = CMP-009-00230-1: as R10 on sheet DisplayDrivare; Source: SamacSys.SchLib; Height: 0.4mm; Manufacturer_Name: Vishay; Datasheet Link: http://www.vishay.com/docs/20035/dcrcwe3.pdf; Manufacturer_Part_Number: CRCW04024K70FKEDHP; Arrow Part Number: CRCW04024K70FKEDHP; Design Item ID: CRCW04024K70FKEDHP; Mouser Price/Stock: https://www.mouser.co.uk/ProductDetail/Vishay-Dale/CRCW04024K70FKEDHP?qs=k2%2FDWSARqgH3ASlI4vM3KQ%3D%3D; Mouser Part Number: 71-CRCW04024K70FKEDH; Arrow Price/Stock: https://www.arrow.com/en/products/crcw04024k70fkedhp/vishay?utm_currency=USD&region=nac
R7 R15 R16 = Generic resistor: Thick Film Resistors Sulfur Tolerant Chip Resistors 0402 case size; ComponentLink1Description: New link
  R7: ComponentLink1URL: *
  R15 R16: ComponentLink1URL: https://www.mouser.se/ProductDetail/ROHM-Semiconductor/SFR01MZPJ470?qs=sGAEpiMZZMvdGkrng054t2cqbZCzJY7NKh3gUwXOa5kuN5TNJ%252Bi2TA%3D%3D
R8 R9 R13 = Generic resistor: ComponentLink1Description: New link; ComponentLink1URL: *
R14 = Generic resistor: as R11 on sheet DisplayDrivare; ComponentLink1Description: New link; ComponentLink1URL: https://www.mouser.se/ProductDetail/Vishay-Dale/CRCW040210K0FKEDC?qs=sGAEpiMZZMvdGkrng054t0DrEhLhGh8ghRTPC4LoFoV0V5heIyAs3Q%3D%3D
U1 = CMP-031-00018-1: ARM Microcontrollers - MCU 16/32-BITS MICROS; Manufacturer_Name: STMicroelectronics; Mouser Part Number: 511-STM32L431CCU6; Height: 0.6mm; Arrow Part Number: STM32L431CCU6; Source: SamacSys.SchLib; Datasheet Link: http://www.st.com/content/ccc/resource/technical/document/datasheet/group3/83/b3/60/f6/b1/cc/47/7e/DM00257211/files/DM00257211.pdf/jcr:content/translations/en.DM00257211.pdf; Arrow Price/Stock: https://www.arrow.com/en/products/stm32l431ccu6/stmicroelectronics?region=nac; Mouser Price/Stock: https://www.mouser.co.uk/ProductDetail/STMicroelectronics/STM32L431CCU6?qs=U58vgkJzipRWiXTJcDrRbg%3D%3D; Manufacturer_Part_Number: STM32L431CCU6; Design Item ID: STM32L431CCU6
X2 = CMP-003-00031-1: as X1 on sheet DisplayDrivare; Manufacturer_Part_Number: WMRAG32K76CS2C00R0; Mouser Part Number: 81-WMRAG32K76CS2C00R; Source: SamacSys.SchLib; Height: 0.35mm; Datasheet Link: https://www.murata.com/products/productdata/8804604674078/SPEC-WMRAG32K76CS2C00R0.pdf; Design Item ID: WMRAG32K76CS2C00R0; Mouser Price/Stock: https://www.mouser.co.uk/ProductDetail/Murata-Electronics/WMRAG32K76CS2C00R0?qs=bZr6mbWTK5kWV2uyypDEfg%3D%3D
Z1 = CMP-004-00065-1: Zener Diode 2.7 V 250 mW +/-7% Surface Mount DFN1006-2; Manufacturer_Name: Diodes Incorporated; Source: SamacSys.SchLib; Height: 0.53mm; Arrow Price/Stock: https://www.arrow.com/en/products/bzt52c2v7lp-7/diodes-incorporated?utm_currency=USD&region=nac; Arrow Part Number: BZT52C2V7LP-7; Mouser Part Number: 621-BZT52C2V7LP-7; Manufacturer_Part_Number: BZT52C2V7LP-7; Design Item ID: BZT52C2V7LP-7; Datasheet Link: https://www.diodes.com/assets/Datasheets/BZT52C2V4LP-BZT52C39LP.pdf; Mouser Price/Stock: https://www.mouser.co.uk/ProductDetail/Diodes-Incorporated/BZT52C2V7LP-7?qs=DwnLFiA34IIEhdzEy1XKTQ%3D%3D

## Nets that join several sheets
GND: DisplayDrivare (28 pins), DigitalBlad (22 pins)
Vcap: DisplayDrivare (P4.1 P7.1 P9.1), DigitalBlad (6 pins)
Vdd: DisplayDrivare (6 pins), DigitalBlad (10 pins)
3V: DisplayDrivare (P5.2), DigitalBlad (R9.1)
alarmA: DisplayDrivare (IC4.A4 R11.2), DigitalBlad (U1.10)
BUSY: DisplayDrivare (P1.9), DigitalBlad (U1.13)
CS: DisplayDrivare (P1.12), DigitalBlad (U1.14)
D/C: DisplayDrivare (P1.11), DigitalBlad (U1.12)
Disp_ON: DisplayDrivare (IC3.B2), DigitalBlad (U1.19)
RES: DisplayDrivare (P1.10), DigitalBlad (U1.11)
SCL2: DisplayDrivare (IC4.C4 R12.1), DigitalBlad (U1.21)
SCLK: DisplayDrivare (P1.13), DigitalBlad (U1.15)
SDA2: DisplayDrivare (IC4.C3 R10.1), DigitalBlad (U1.22)
SDI: DisplayDrivare (P1.14), DigitalBlad (U1.17)